# Altium schematic sheet PWM_control.SchDoc
size A4; SheetNumber: 3; SheetTotal: 5
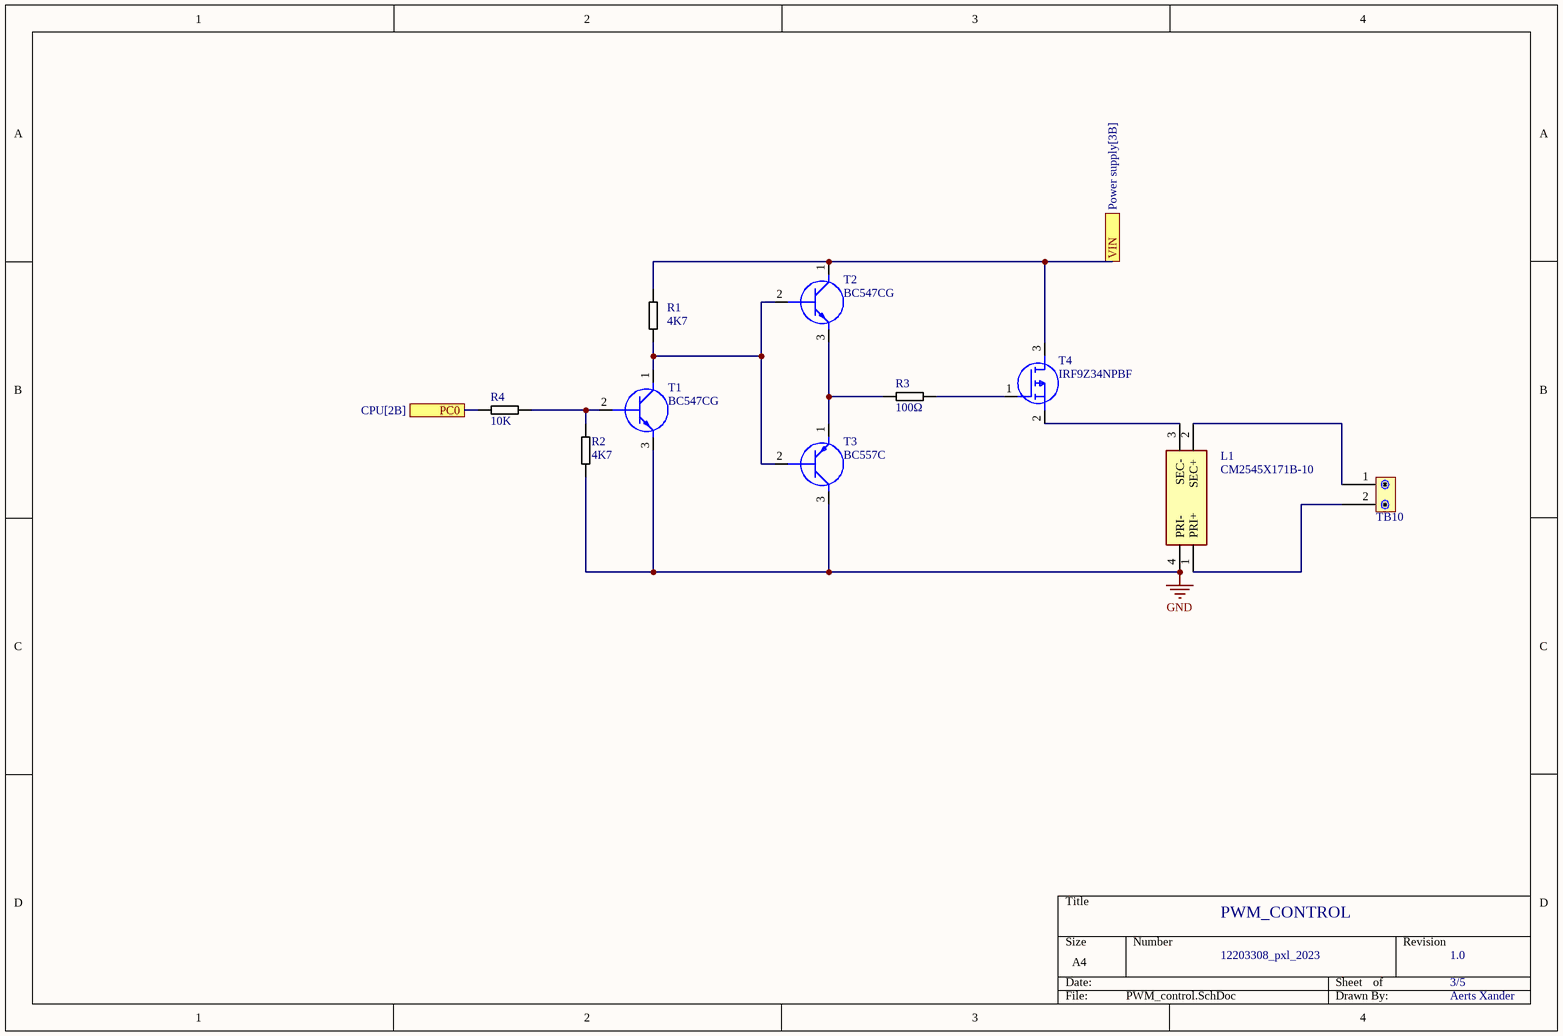
[diagram p0: PWM_control.SchDoc]

## Parts
L1  CM2545X171B-10  [CM2545X171B-10]
R1  4K7  [0805]
R2  4K7  [0805]
R3  100Ω  [0805]
R4  10K  [0805]
T1  BC547CG  [BC547CG]
T2  BC547CG  [BC547CG]
T3  BC557C  [BC557C]
T4  IRF9Z34NPBF  [IRF9Z34NPBF]
TB10  2pin screw connector  [2pin screw connector]  (value not drawn)

## Ports
PC0 (see CPU[2B]), VIN (see Power supply[3B])

## Nets
GND: L1.4(PRI-) R2.1 T1.3(E) T3.3(C)
PC0: R4.2 ; port PC0
VIN: R1.2 T2.1(C) T4.3(D) ; port VIN
NetL1_1: L1.1(PRI+) TB10.2
NetL1_2: L1.2(SEC+) TB10.1
NetL1_3: L1.3(SEC-) T4.2(S)
NetR1_1: R1.1 T1.1(C) T2.2(B) T3.2(B)
NetR2_2: R2.2 R4.1 T1.2(B)
NetR3_1: R3.1 T4.1(G)
NetR3_2: R3.2 T2.3(E) T3.1(E)

## Notes on the sheet
- PWM_CONTROL
- 12203308_pxl_2023
- 1.0
- 3/5
- Aerts Xander

## Library data of the parts
L1 = CM2545X171B-10: Transformer; Manufacturer_Name: Laird Technologies; Datasheet Link: https://datasheet.datasheetarchive.com/originals/dk/DKDS-7/122753.pdf; Height: 9.5mm; Manufacturer_Part_Number: CM2545X171B-10; Mouser Part Number: N/A; Mouser Price/Stock: https://www.mouser.co.uk/ProductDetail/Laird/CM2545X171B-10?qs=PzGy0jfpSMtNfkEypgU65A%3D%3D; Arrow Part Number: CM2545X171B-10; Arrow Price/Stock: https://www.arrow.com/en/products/cm2545x171b-10/laird-technologies
R1-R4 = resistor: Manufacturer: Vishay Dale; Part Number: CRCW08050000Z0EA
T1 T2 = BC547CG: Transistor BJT NPN; Manufacturer_Name: onsemi; Datasheet Link: https://www.onsemi.com/pub/Collateral/BC546-D.PDF; Height: 5.33mm; Manufacturer_Part_Number: BC547CG; Mouser Part Number: 863-BC547CG; Mouser Price/Stock: https://www.mouser.co.uk/ProductDetail/onsemi/BC547CG?qs=vLkC5FC1VN%252BHx9C8w0tCew%3D%3D; Arrow Part Number: BC547CG; Arrow Price/Stock: https://www.arrow.com/en/products/bc547cg/on-semiconductor?region=nac
T3 = BC557C: Transistor BJT PNP; Manufacturer_Name: NXP; Datasheet Link: http://uk.rs-online.com/web/p/products/1124775; Height: 5.2mm; Manufacturer_Part_Number: BC557C; Mouser Part Number: 771-BC557C; Mouser Price/Stock: https://www.mouser.co.uk/ProductDetail/NXP-Semiconductors/BC557C?qs=84A%2FDAdkstLO1yR4NjQrgg%3D%3D
T4 = IRF9Z34NPBF: MOSFET (P-Channel); Manufacturer_Name: Infineon; Datasheet Link: https://www.infineon.com/dgdl/irf9z34npbf.pdf?fileId=5546d462533600a40153561220af1ddd; Height: 4.69mm; Manufacturer_Part_Number: IRF9Z34NPBF; Mouser Part Number: 942-IRF9Z34NPBF; Mouser Price/Stock: https://www.mouser.co.uk/ProductDetail/Infineon-Technologies/IRF9Z34NPBF?qs=9%252BKlkBgLFf16a%2FvlD%252BMCtQ%3D%3D; Arrow Part Number: IRF9Z34NPBF; Arrow Price/Stock: https://www.arrow.com/en/products/irf9z34npbf/infineon-technologies-ag?region=nac